# Altium schematic sheet EpicCubeDiagram2.SchDoc: Epic Cube Diagram
size B; CompanyName: Smart Home; DrawnBy: Levi Balling; Engineer: Levi Balling; Organization: U of U Computer Engineering; Address1: 50 S Central Campus Dr.; Address2: Rm. 3280 MEB; Address3: SLC, UT 84112; DocumentNumber: 1; Revision: 1; SheetNumber: 3; SheetTotal: 13; Project: Smart Home; Website: www.eng.utah.edu/~lballing/SmartHome
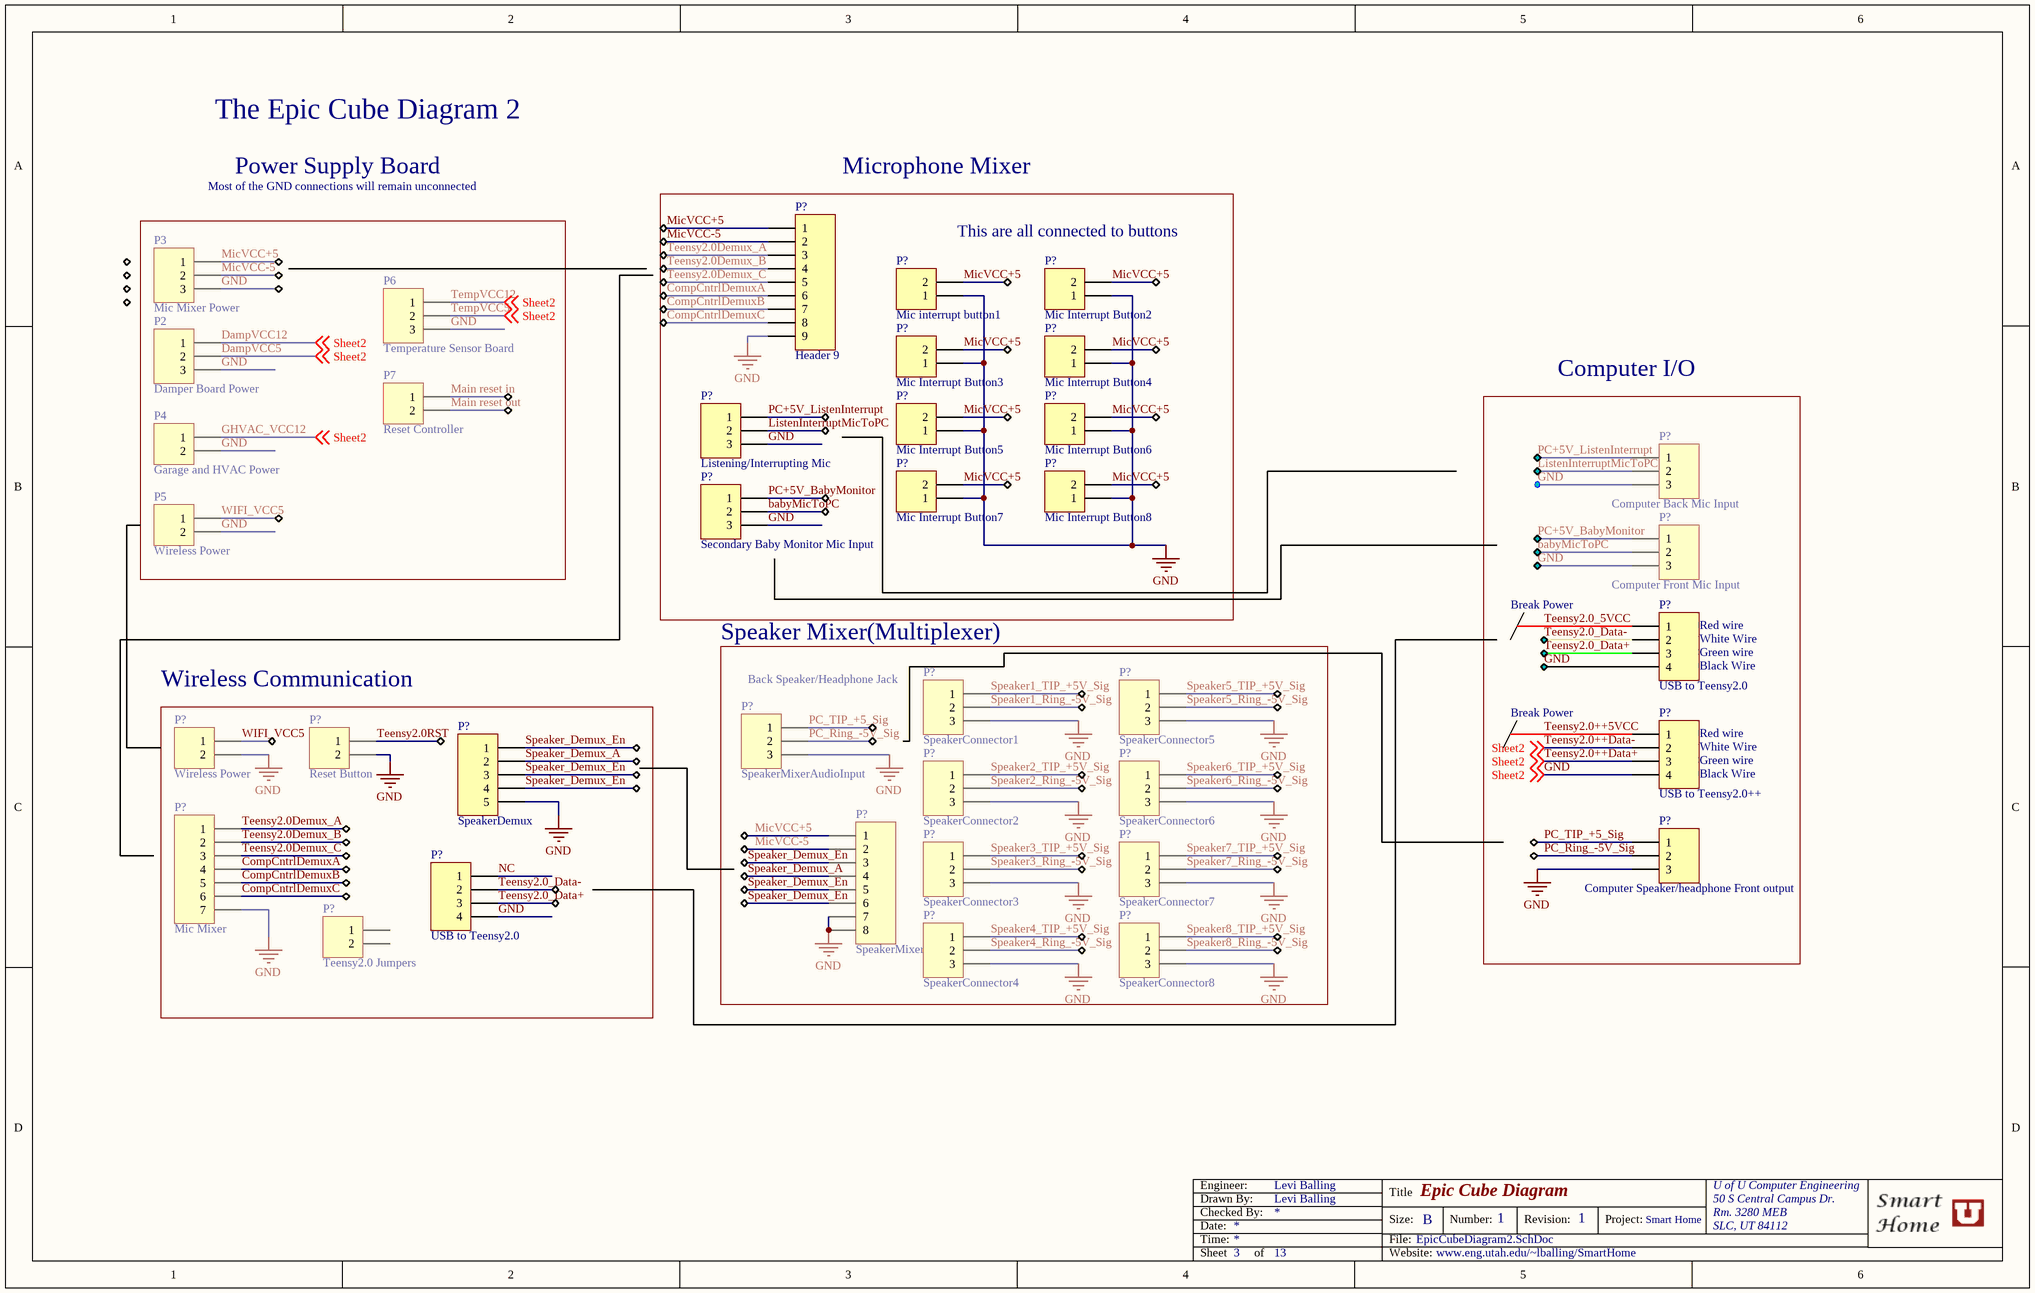
[diagram p0: EpicCubeDiagram2.SchDoc]

## Parts
(Parts that share a designator on the sheet are numbered #1, #2 ... from top to bottom, then left to right.)
P2  Damper Board Power  [HDR1X3]
P3  Mic Mixer Power  [HDR1X3]
P4  Garage and HVAC Power  [HDR1X2]
P5  Wireless Power  [HDR1X2]
P6  Temperature Sensor Board  [HDR1X3]
P7  Reset Controller  [HDR1X2]
P?#1  Header 9  [HDR1X9]
P?#2  Mic interrupt button1  [HDR1X2]
P?#3  Mic Interrupt Button2  [HDR1X2]
P?#4  Mic Interrupt Button3  [HDR1X2]
P?#5  Mic Interrupt Button4  [HDR1X2]
P?#6  Listening/Interrupting Mic  [HDR1X3]
P?#7  Mic Interrupt Button5  [HDR1X2]
P?#8  Mic Interrupt Button6  [HDR1X2]
P?#9  Computer Back Mic Input  [HDR1X3]
P?#10  Secondary Baby Monitor Mic Input  [HDR1X3]
P?#11  Mic Interrupt Button7  [HDR1X2]
P?#12  Mic Interrupt Button8  [HDR1X2]
P?#13  Computer Front Mic Input  [HDR1X3]
P?#14  USB to Teensy2.0  [HDR1X4]
P?#15  SpeakerConnector1  [HDR1X3]
P?#16  SpeakerConnector5  [HDR1X3]
P?#17  SpeakerMixerAudioInput  [HDR1X3]
P?#18  USB to Teensy2.0++  [HDR1X4]
P?#19  Wireless Power  [HDR1X2]
P?#20  Reset Button  [HDR1X2]
P?#21  SpeakerDemux  [HDR1X5]
P?#22  SpeakerConnector2  [HDR1X3]
P?#23  SpeakerConnector6  [HDR1X3]
P?#24  Mic Mixer  [HDR1X7]
P?#25  SpeakerMixer  [HDR1X8]
P?#26  Computer Speaker/headphone Front output  [HDR1X3]
P?#27  SpeakerConnector3  [HDR1X3]
P?#28  SpeakerConnector7  [HDR1X3]
P?#29  USB to Teensy2.0  [HDR1X4]
P?#30  Teensy2.0 Jumpers  [HDR1X2]
P?#31  SpeakerConnector4  [HDR1X3]
P?#32  SpeakerConnector8  [HDR1X3]

## Blocks framed on the sheet
Microphone Mixer: P?#1-P?#8 P?#10-P?#12
Computer I/O: P?#9 P?#13 P?#14 P?#18 P?#26
Speaker Mixer(Multiplexer): P?#15-P?#17 P?#22 P?#23 P?#25 P?#27 P?#28 P?#31 P?#32
Wireless Communication: P?#19-P?#21 P?#24 P?#29 P?#30

## Nets
DampVCC12: P2.1 P2.2 P2.3 P3.3 P4.1 P4.2 P5.2 P6.1 P6.2 P6.3 P?#1.9 P?#2.1 P?#3.1 P?#4.1 P?#5.1 P?#6.3 P?#7.1 P?#8.1 P?#9.3 P?#10.3 P?#11.1 P?#12.1 P?#13.3 P?#14.4 P?#15.3 P?#16.3 P?#17.3 P?#18.2 P?#18.3 P?#18.4 P?#19.2 P?#20.2 P?#21.5 P?#22.3 P?#23.3 P?#24.7 P?#25.7 P?#25.8 P?#26.3 P?#27.3 P?#28.3 P?#29.4 P?#31.3 P?#32.3 ; off-sheet Sheet2  [also labelled DampVCC5, GHVAC_VCC12, GND, Sheet2, Teensy2.0++Data+, Teensy2.0++Data-, TempVCC12, TempVCC5]
babyMicToPC: P?#10.2 P?#13.2
CompCntrlDemuxA: P?#1.6 P?#24.4
CompCntrlDemuxB: P?#1.7 P?#24.5
CompCntrlDemuxC: P?#1.8 P?#24.6
ListenInterruptMicToPC: P?#6.2 P?#9.2
Main reset in: P7.1
Main reset out: P7.2
MicVCC+5: P3.1 P?#1.1 P?#2.2 P?#3.2 P?#4.2 P?#5.2 P?#7.2 P?#8.2 P?#11.2 P?#12.2 P?#25.1
MicVCC-5: P3.2 P?#1.2 P?#25.2
NC: P?#29.1
PC+5V_BabyMonitor: P?#10.1 P?#13.1
PC+5V_ListenInterrupt: P?#6.1 P?#9.1
PC_Ring_-5V_Sig: P?#17.2 P?#26.2
PC_TIP_+5_Sig: P?#17.1 P?#26.1
Speaker1_Ring_-5V_Sig: P?#15.2
Speaker1_TIP_+5V_Sig: P?#15.1
Speaker2_Ring_-5V_Sig: P?#22.2
Speaker2_TIP_+5V_Sig: P?#22.1
Speaker3_Ring_-5V_Sig: P?#27.2
Speaker3_TIP_+5V_Sig: P?#27.1
Speaker4_Ring_-5V_Sig: P?#31.2
Speaker4_TIP_+5V_Sig: P?#31.1
Speaker5_Ring_-5V_Sig: P?#16.2
Speaker5_TIP_+5V_Sig: P?#16.1
Speaker6_Ring_-5V_Sig: P?#23.2
Speaker6_TIP_+5V_Sig: P?#23.1
Speaker7_Ring_-5V_Sig: P?#28.2
Speaker7_TIP_+5V_Sig: P?#28.1
Speaker8_Ring_-5V_Sig: P?#32.2
Speaker8_TIP_+5V_Sig: P?#32.1
Speaker_Demux_A: P?#21.2 P?#25.4
Speaker_Demux_En: P?#21.1 P?#21.3 P?#21.4 P?#25.3 P?#25.5 P?#25.6
Teensy2.0++5VCC: P?#18.1
Teensy2.0_5VCC: P?#14.1
Teensy2.0_Data+: P?#14.3 P?#29.3
Teensy2.0_Data-: P?#14.2 P?#29.2
Teensy2.0Demux_A: P?#1.3 P?#24.1
Teensy2.0Demux_B: P?#1.4 P?#24.2
Teensy2.0Demux_C: P?#1.5 P?#24.3
Teensy2.0RST: P?#20.1
WIFI_VCC5: P5.1 P?#19.1

Not connected (* = marked no-connect by the designer): P?#30 1 2

## Notes on the sheet
- The Epic Cube Diagram 2
- Most of the GND connections will remain unconnected
- Power Supply Board
- (near P?#3) This are all connected to buttons
- Break Power
- (near P?#14) Red wire
- (near P?#14) White Wire
- (near P?#17) Back Speaker/Headphone Jack
- (near P?#14) Green wire
- (near P?#14) Black Wire
- (near P?#18) Red wire
- (near P?#18) White Wire
- (near P?#18) Green wire
- (near P?#18) Black Wire
- Date:
- Time:
- Engineer:
- Drawn By:
- Checked By:
- Title
- Size:
- File:
- B
- Number:
- Revision:
- Project:
- Sheet
- of
- Website:

## Library data of the parts
P2 P3 P6 P?#6 P?#9 P?#10 P?#13 P?#15-P?#17 P?#22 P?#23 P?#26-P?#28 P?#31 P?#32 = Header 3: Header, 3-Pin; Vendor: Taydaelectronics; LatestRevisionDate: 17-Jul-2002; LatestRevisionNote: Re-released for DXP Platform.; Publisher: Altium Limited; Price: 0.03; Value: Header 3
P4 P5 P7 P?#2-P?#5 P?#7 P?#8 P?#11 P?#12 P?#19 P?#20 P?#30 = Header 2: Header, 2-Pin; Vendor: Taydaelectronics; LatestRevisionDate: 17-Jul-2002; LatestRevisionNote: Re-released for DXP Platform.; Publisher: Altium Limited; Price: 0.02; Value: Header 2
P?#1 = Header 9: Header, 9-Pin; Vendor: Taydaelectronics; LatestRevisionDate: 17-Jul-2002; LatestRevisionNote: Re-released for DXP Platform.; Publisher: Altium Limited; Price: 0.09; Value: Header 9
P?#14 P?#18 P?#29 = Header 4: Header, 4-Pin; Vendor: Taydaelectronics; LatestRevisionDate: 17-Jul-2002; LatestRevisionNote: Re-released for DXP Platform.; Publisher: Altium Limited; Price: 0.04; Value: Header 4
P?#21 = Header 5: Header, 5-Pin; Vendor: Taydaelectronics; LatestRevisionDate: 17-Jul-2002; LatestRevisionNote: Re-released for DXP Platform.; Publisher: Altium Limited; Price: 0.05; Value: Header 5
P?#24 = Header 7: Header, 7-Pin; Vendor: Taydaelectronics; LatestRevisionDate: 17-Jul-2002; LatestRevisionNote: Re-released for DXP Platform.; Publisher: Altium Limited; Price: 0.07; Value: Header 7
P?#25 = Header 8: Header, 8-Pin; Vendor: Taydaelectronics; LatestRevisionDate: 17-Jul-2002; LatestRevisionNote: Re-released for DXP Platform.; Publisher: Altium Limited; Price: 0.08; Value: Header 8